# Altium schematic sheet Converter_Current_Voltage_Measurement.SchDoc: Current - Voltage Measurement
size A4; CompanyName: -; DrawnBy: Naldi, López; Revision: 1; SheetNumber: 4; SheetTotal: 4; Number: 25
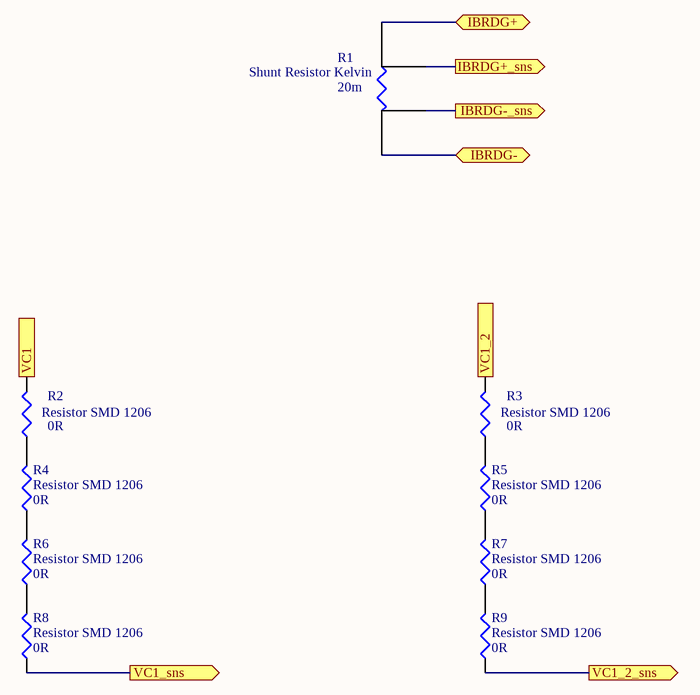
[diagram p0: Converter_Current_Voltage_Measurement.SchDoc]

## Parts
R1  Shunt Resistor Kelvin  value 20m  [Chip2PinSM127P600-8N]
R2  Resistor SMD 1206  value 0R  [RESC3116X07N - 1206]
R3  Resistor SMD 1206  value 0R  [RESC3116X07N - 1206]
R4  Resistor SMD 1206  value 0R  [RESC3116X07N - 1206]
R5  Resistor SMD 1206  value 0R  [RESC3116X07N - 1206]
R6  Resistor SMD 1206  value 0R  [RESC3116X07N - 1206]
R7  Resistor SMD 1206  value 0R  [RESC3116X07N - 1206]
R8  Resistor SMD 1206  value 0R  [RESC3116X07N - 1206]
R9  Resistor SMD 1206  value 0R  [RESC3116X07N - 1206]

## Ports
IBRDG+ (bidir), IBRDG+_sns (out), IBRDG- (bidir), IBRDG-_sns (out), VC1 (in), VC1_2 (in), VC1_2_sns (out), VC1_sns (out)

## Nets
IBRDG+: R1.1 ; port IBRDG+
IBRDG+_sns: R1.2 ; port IBRDG+_sns
IBRDG-: R1.4 ; port IBRDG-
IBRDG-_sns: R1.3 ; port IBRDG-_sns
VC1: R2.2 ; port VC1
VC1_2: R3.2 ; port VC1_2
VC1_2_sns: R9.1 ; port VC1_2_sns
VC1_sns: R8.1 ; port VC1_sns
NetR2_1: R2.1 R4.2
NetR3_1: R3.1 R5.2
NetR4_1: R4.1 R6.2
NetR5_1: R5.1 R7.2
NetR6_1: R6.1 R8.2
NetR7_1: R7.1 R9.2

## Notes on the sheet
- Title
- Size:
- Project:
- A4
- Number:
- Revision:
- Sheet
- of
- Drawn by:
- Company:
- File:

## Library data of the parts
R1 = Shunt Resistor Kelvin: Published: 8-Jun-2000; LatestRevisionDate: 29-May-2009; LatestRevisionNote: IPC-7351 Footprint Added.; PackageReference: J1-0603; Publisher: Altium Limited; PackageDescription: Chip Resistor
R2-R9 = Resistor SMD 1206: Published: 8-Jun-2000; LatestRevisionDate: 29-May-2009; LatestRevisionNote: IPC-7351 Footprint Added.; PackageReference: J1-0603; Publisher: Altium Limited; PackageDescription: Chip Resistor